# Altium schematic sheet mem.SchDoc
size Tabloid
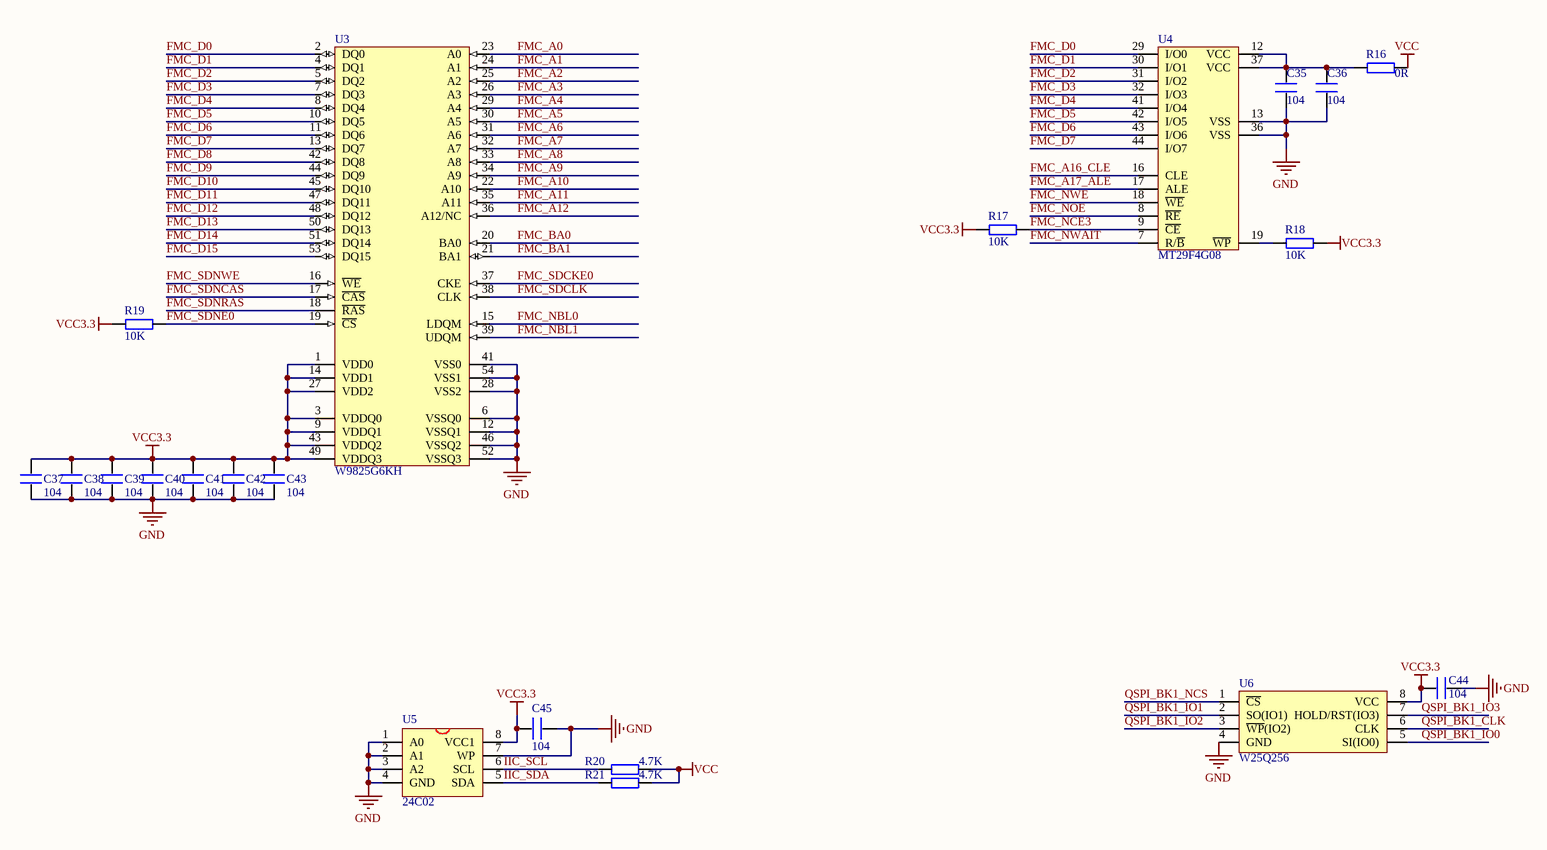
[diagram p0: mem.SchDoc]

## Parts
C35  104  [0805]
C36  104  [0805]
C37  104  [0805]
C38  104  [0805]
C39  104  [0805]
C40  104  [0805]
C41  104  [0805]
C42  104  [0805]
C43  104  [0805]
C44  104  [0805]
C45  104  [0805]
R16  0R  [0805]
R17  10K  [0805]
R18  10K  [0805]
R19  10K  [0805]
R20  4.7K  [0805]
R21  4.7K  [0805]
U3  W9825G6KH  [TSOP54]
U4  MT29F4G08  [TSOP48]
U5  24C02  [SOP-8]
U6  W25Q256  [WSON8]

## Nets
GND: C35.1 C36.1 C37.1 C38.1 C39.1 C40.1 C41.1 C42.1 C43.1 C44.2 C45.2 U3.6(VSSQ0) U3.12(VSSQ1) U3.28(VSS2) U3.41(VSS0) U3.46(VSSQ2) U3.52(VSSQ3) U3.54(VSS1) U4.13(VSS) U4.36(VSS) U5.1(A0) U5.2(A1) U5.3(A2) U5.4(GND) U5.7(WP) U6.4(GND)
VCC: R16.2 R20.2 R21.2
VCC3.3: C37.2 C38.2 C39.2 C40.2 C41.2 C42.2 C43.2 C44.1 C45.1 R17.1 R18.2 R19.1 U3.1(VDD0) U3.3(VDDQ0) U3.9(VDDQ1) U3.14(VDD1) U3.27(VDD2) U3.43(VDDQ2) U3.49(VDDQ3) U5.8(VCC1) U6.8(VCC)
FMC_A0: U3.23(A0)
FMC_A1: U3.24(A1)
FMC_A2: U3.25(A2)
FMC_A3: U3.26(A3)
FMC_A4: U3.29(A4)
FMC_A5: U3.30(A5)
FMC_A6: U3.31(A6)
FMC_A7: U3.32(A7)
FMC_A8: U3.33(A8)
FMC_A9: U3.34(A9)
FMC_A10: U3.22(A10)
FMC_A11: U3.35(A11)
FMC_A12: U3.36(A12/NC)
FMC_A16_CLE: U4.16(CLE)
FMC_A17_ALE: U4.17(ALE)
FMC_BA0: U3.20(BA0)
FMC_BA1: U3.21(BA1)
FMC_D0: U3.2(DQ0) U4.29(I/O0)
FMC_D1: U3.4(DQ1) U4.30(I/O1)
FMC_D2: U3.5(DQ2) U4.31(I/O2)
FMC_D3: U3.7(DQ3) U4.32(I/O3)
FMC_D4: U3.8(DQ4) U4.41(I/O4)
FMC_D5: U3.10(DQ5) U4.42(I/O5)
FMC_D6: U3.11(DQ6) U4.43(I/O6)
FMC_D7: U3.13(DQ7) U4.44(I/O7)
FMC_D8: U3.42(DQ8)
FMC_D9: U3.44(DQ9)
FMC_D10: U3.45(DQ10)
FMC_D11: U3.47(DQ11)
FMC_D12: U3.48(DQ12)
FMC_D13: U3.50(DQ13)
FMC_D14: U3.51(DQ14)
FMC_D15: U3.53(DQ15)
FMC_NBL0: U3.15(LDQM)
FMC_NBL1: U3.39(UDQM)
FMC_NCE3: R17.2 U4.9(~{CE})
FMC_NOE: U4.8(~{RE})
FMC_NWAIT: U4.7(R/~{B})
FMC_NWE: U4.18(~{WE})
FMC_SDCKE0: U3.37(CKE)
FMC_SDCLK: U3.38(CLK)
FMC_SDNCAS: U3.17(~{CAS})
FMC_SDNE0: R19.2 U3.19(~{CS})
FMC_SDNRAS: U3.18(~{RAS})
FMC_SDNWE: U3.16(~{WE})
IIC_SCL: R20.1 U5.6(SCL)
IIC_SDA: R21.1 U5.5(SDA)
QSPI_BK1_CLK: U6.6(CLK)
QSPI_BK1_IO0: U6.5(SI(IO0))
QSPI_BK1_IO1: U6.2(SO(IO1))
QSPI_BK1_IO2: U6.3(~{WP}(IO2))
QSPI_BK1_IO3: U6.7(HOLD/RST(IO3))
QSPI_BK1_NCS: U6.1(~{CS})
NetC35_2: C35.2 C36.2 R16.1 U4.12(VCC) U4.37(VCC)
NetR18_1: R18.1 U4.19(~{WP})

## Library data of the parts
C35-C45 = C
R16-R21 = R
U3 = IS42S16160B: 32MB SDRAM
U4 = K9F2G08U0C: 256MB NAND FLASH
U5 = 24C256: EEPROM
U6 = W25Q128